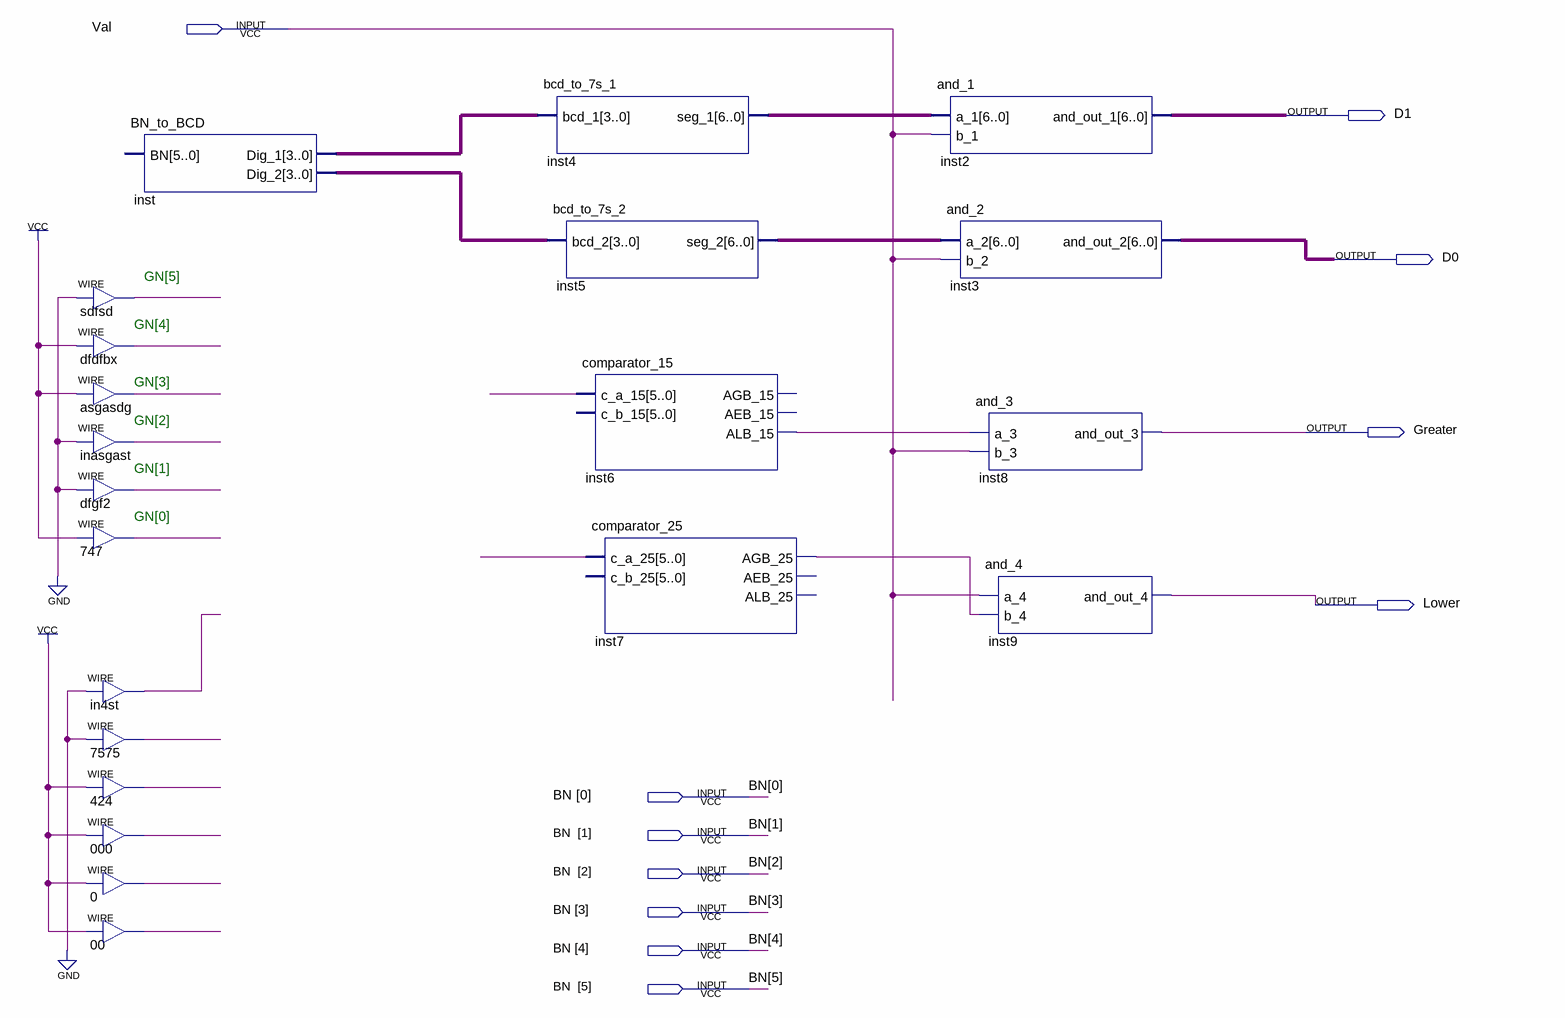
[diagram p0: schematic sheet]
// Quartus schematic Block1.bdf as structural Verilog: 21 symbols, 11 pins
module Block1 (
  input  Val,
  input  [5:0] BN,
  output D1,
  output D0,
  output Greater,
  output Lower
);

  wire asgasdg_out, dfdfbx_out, dfgf2_out, in4st_out, inasgast_out, inst6_alb_15, inst7_agb_25, n00_out,
       n0_out, n000_out, n424_out, n747_out, n7575_out, sdfsd_out, undriven, undriven_2;
  wire [3:0] inst_dig_1, inst_dig_2;
  wire [6:0] inst2_and_out_1, inst3_and_out_2, inst4_seg_1, inst5_seg_2;

  assign sdfsd_out = 1'b0;  // WIRE sdfsd
  assign dfdfbx_out = 1'b1;  // WIRE dfdfbx
  assign asgasdg_out = 1'b1;  // WIRE asgasdg
  assign inasgast_out = 1'b0;  // WIRE inasgast
  assign dfgf2_out = 1'b0;  // WIRE dfgf2
  assign n747_out = 1'b1;  // WIRE 747
  assign in4st_out = 1'b0;  // WIRE in4st
  assign n7575_out = 1'b0;  // WIRE 7575
  assign n424_out = 1'b1;  // WIRE 424
  assign n000_out = 1'b1;  // WIRE 000
  assign n0_out = 1'b1;  // WIRE 0
  assign n00_out = 1'b1;  // WIRE 00
  BN_to_BCD inst (.Dig_1(inst_dig_1), .Dig_2(inst_dig_2));  // open: BN
  bcd_to_7s_1 inst4 (.bcd_1(inst_dig_1), .seg_1(inst4_seg_1));
  bcd_to_7s_2 inst5 (.bcd_2(inst_dig_2), .seg_2(inst5_seg_2));
  comparator_15 inst6 (.c_a_15({6{undriven_2}}), .ALB_15(inst6_alb_15));  // open: c_b_15, AGB_15, AEB_15
  comparator_25 inst7 (.c_a_25({6{undriven}}), .AGB_25(inst7_agb_25));  // open: c_b_25, AEB_25, ALB_25
  and_1 inst2 (.a_1(inst4_seg_1), .b_1(Val), .and_out_1(inst2_and_out_1));
  and_2 inst3 (.a_2(inst5_seg_2), .b_2(Val), .and_out_2(inst3_and_out_2));
  and_3 inst8 (.a_3(inst6_alb_15), .b_3(Val), .and_out_3(Greater));
  and_4 inst9 (.a_4(Val), .b_4(inst7_agb_25), .and_out_4(Lower));

  // Notes on the sheet:
  //   GN[5]
  //   GN[4]
  //   GN[3]
  //   GN[2]
  //   GN[1]
  //   GN[0]
endmodule
